# Altium schematic sheet Hydrophones_Front_Plane_1.SchDoc
size A
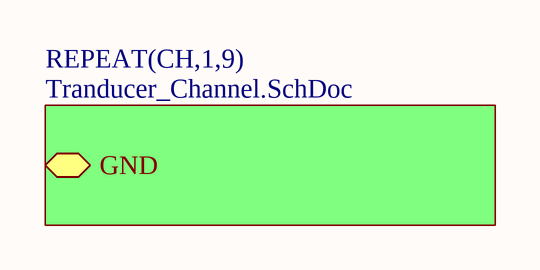
[diagram p0: Hydrophones_Front_Plane_1.SchDoc]

## Sub-sheets
REPEAT(CH,1,9) = Tranducer_Channel.SchDoc: GND